# Altium project iSEB_SoundRecognition_2503.PrjPcb
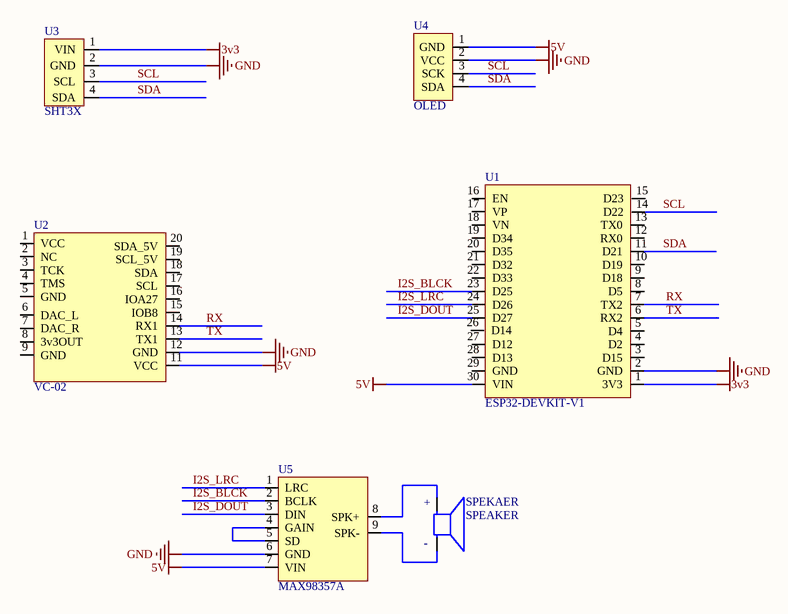
[diagram p0: iSEB_SoundRecognition_2503.SchDoc]
1 sheet, 6 parts. Net scope: global (net labels, ports and power ports of the same name join across sheets).

## Sheet iSEB_SoundRecognition_2503.SchDoc
size A4; SheetNumber: 1; SheetTotal: 1

### Parts
SPEKAER  SPEAKER  [SPKR_AST-03208MR-R]
U1  ESP32-DEVKIT-V1  [MODULE_ESP32_DEVKIT_V1]
U2  VC-02
U3  SHT3X
U4  OLED
U5  MAX98357A

### Nets
3v3: U1.1(3V3) U3.1(VIN)
5V: U1.30(VIN) U2.11(VCC) U4.1(GND) U5.7(VIN)
GND: U1.2(GND) U2.12(GND) U3.2(GND) U4.2(VCC) U5.6(GND)
I2S_BLCK: U1.23(D25) U5.2(BCLK)
I2S_DOUT: U1.25(D27) U5.3(DIN)
I2S_LRC: U1.24(D26) U5.1(LRC)
RX: U1.7(TX2) U2.14(RX1)
SCL: U1.14(D22) U3.3(SCL) U4.3(SCK)
SDA: U1.11(D21) U3.4(SDA) U4.4(SDA)
TX: U1.6(RX2) U2.13(TX1)
NetSPEKAER_N: SPEKAER.N(NEG) U5.9(SPK-)
NetSPEKAER_P: SPEKAER.P(POS) U5.8(SPK+)
NetU5_4: U5.4(GAIN) U5.5(SD)

Not connected (* = marked no-connect by the designer): U1 3(D15) 4(D2) 5(D4) 8(D5) 9(D18) 10(D19) 12(RX0) 13(TX0) 15(D23) 16(EN) 17(VP) 18(VN) 19(D34) 20(D35) 21(D32) 22(D33) 26(D14) 27(D12) 28(D13) 29(GND); U2 1(VCC) 2(NC) 3(TCK) 4(TMS) 5(GND) 6(DAC_L) 7(DAC_R) 8(3v3OUT) 9(GND) 15(IOB8) 16(IOA27) 17(SCL) 18(SDA) 19(SCL_5V) 20(SDA_5V)

### Notes on the sheet
- (in symbol SPEAKER) +; -

### Library data of the parts
SPEKAER = SPEAKER: MP: AST-03208MR-R; Package: None; Price: None; Value: *; Availability: Unavailable
U1 = ESP32-DEVKIT-V1_NO_SOCKET: Dual core, Wi-Fi: 2.4 GHz up to 150 Mbits/s,BLE (Bluetooth Low Energy) and legacy Bluetooth, 32 bits, Up to 240 MHz; MF: Do it; Price: None; Availability: Not in stock; Package: None; MP: ESP32-DEVKIT-V1; Value: *; SnapEDA_Link: https://www.snapeda.com/parts/ESP32-DEVKIT-V1/Do+it/view-part/?ref=snap; Check_prices: https://www.snapeda.com/parts/ESP32-DEVKIT-V1/Do+it/view-part/?ref=eda